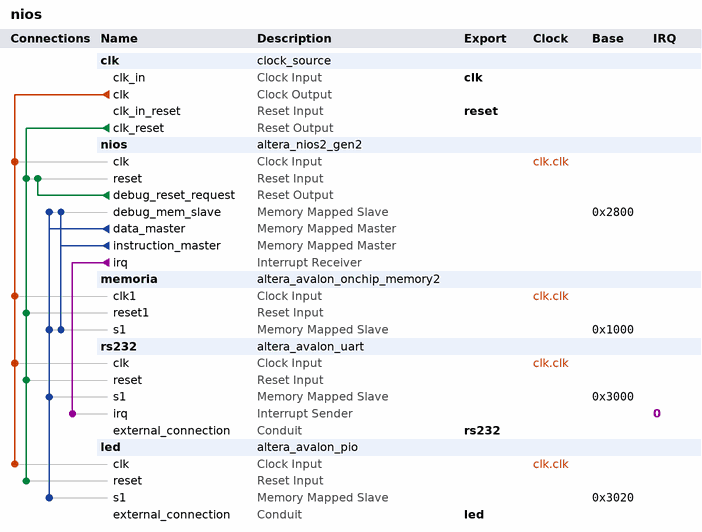
[diagram p0: system contents]
# Platform Designer (Qsys) system nios, Cyclone IV E EP4CE30F23C7
# Parameters at their usual value, and those the tool derives, are not listed.
package require -exact qsys 17.0
create_system nios
set_project_property DEVICE_FAMILY {Cyclone IV E}
set_project_property DEVICE EP4CE30F23C7

add_instance clk clock_source 17.0
set_instance_parameter_value clk clockFrequency 50000000

add_instance nios altera_nios2_gen2 17.0
set_instance_parameter_value nios dcache_size 2048
set_instance_parameter_value nios exceptionSlave memoria.s1
set_instance_parameter_value nios icache_size 4096
set_instance_parameter_value nios impl Tiny
set_instance_parameter_value nios resetSlave memoria.s1

add_instance memoria altera_avalon_onchip_memory2 17.0
set_instance_parameter_value memoria dataWidth 32
set_instance_parameter_value memoria dualPort false
set_instance_parameter_value memoria initMemContent true
set_instance_parameter_value memoria initializationFileName uart.hex
set_instance_parameter_value memoria memorySize 4096
set_instance_parameter_value memoria useNonDefaultInitFile true

add_instance rs232 altera_avalon_uart 17.0
set_instance_parameter_value rs232 baud 115200
set_instance_parameter_value rs232 dataBits 8
set_instance_parameter_value rs232 fixedBaud true
set_instance_parameter_value rs232 parity NONE
set_instance_parameter_value rs232 stopBits 1

add_instance led altera_avalon_pio 17.0
set_instance_parameter_value led direction Output
set_instance_parameter_value led width 8

# connections
add_connection clk.clk led.clk clock
add_connection clk.clk memoria.clk1 clock
add_connection clk.clk nios.clk clock
add_connection clk.clk rs232.clk clock
add_connection clk.clk_reset led.reset reset
add_connection clk.clk_reset memoria.reset1 reset
add_connection clk.clk_reset nios.reset reset
add_connection clk.clk_reset rs232.reset reset
add_connection nios.debug_reset_request nios.reset reset
add_connection nios.data_master led.s1 avalon
set_connection_parameter_value nios.data_master/led.s1 baseAddress 0x3020
add_connection nios.data_master memoria.s1 avalon
set_connection_parameter_value nios.data_master/memoria.s1 baseAddress 0x1000
add_connection nios.data_master nios.debug_mem_slave avalon
set_connection_parameter_value nios.data_master/nios.debug_mem_slave baseAddress 0x2800
add_connection nios.data_master rs232.s1 avalon
set_connection_parameter_value nios.data_master/rs232.s1 baseAddress 0x3000
add_connection nios.instruction_master memoria.s1 avalon
set_connection_parameter_value nios.instruction_master/memoria.s1 baseAddress 0x1000
add_connection nios.instruction_master nios.debug_mem_slave avalon
set_connection_parameter_value nios.instruction_master/nios.debug_mem_slave baseAddress 0x2800
add_connection nios.irq rs232.irq interrupt
set_connection_parameter_value nios.irq/rs232.irq irqNumber 0

# exported interfaces
add_interface clk clock sink
set_interface_property clk EXPORT_OF clk.clk_in
add_interface led conduit end
set_interface_property led EXPORT_OF led.external_connection
add_interface reset reset sink
set_interface_property reset EXPORT_OF clk.clk_in_reset
add_interface rs232 conduit end
set_interface_property rs232 EXPORT_OF rs232.external_connection

set_interconnect_requirement {$system} qsys_mm.clockCrossingAdapter HANDSHAKE
set_interconnect_requirement {$system} qsys_mm.enableEccProtection FALSE
set_interconnect_requirement {$system} qsys_mm.insertDefaultSlave FALSE
set_interconnect_requirement {$system} qsys_mm.maxAdditionalLatency 1

save_system nios.qsys
